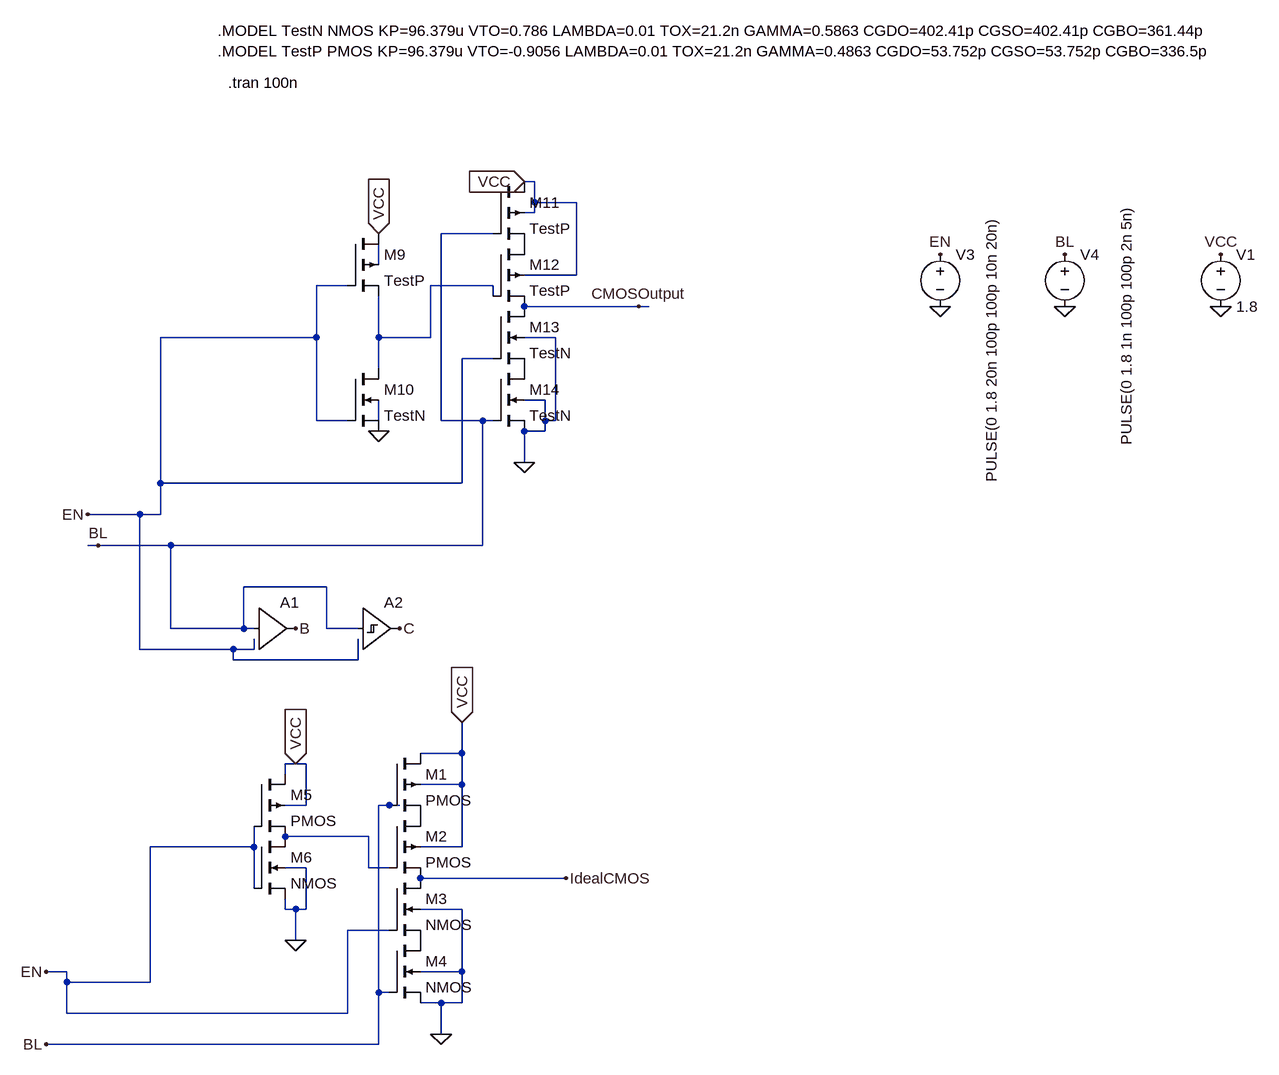
[diagram p0: schematic Tristatetest.asc]
Tristatetest.asc, the LTspice schematic file:
Version 4
SHEET 1 2480 2656
WIRE -128 96 -144 96
WIRE -128 128 -128 96
WIRE -64 128 -128 128
WIRE -128 144 -128 128
WIRE -128 144 -144 144
WIRE -192 176 -272 176
WIRE -368 224 -368 192
WIRE -64 240 -64 128
WIRE -64 240 -144 240
WIRE -416 256 -464 256
WIRE -192 256 -288 256
WIRE -192 272 -192 256
WIRE 32 288 -144 288
WIRE 48 288 32 288
WIRE -464 336 -464 256
WIRE -464 336 -704 336
WIRE -368 336 -368 272
WIRE -288 336 -288 256
WIRE -288 336 -368 336
WIRE -96 336 -144 336
WIRE -192 368 -240 368
WIRE -368 384 -368 336
WIRE -112 432 -144 432
WIRE -464 464 -464 336
WIRE -416 464 -464 464
WIRE -368 464 -368 432
WIRE -272 464 -272 176
WIRE -208 464 -272 464
WIRE -192 464 -208 464
WIRE -112 464 -112 432
WIRE -96 464 -96 336
WIRE -96 464 -112 464
WIRE -112 480 -112 464
WIRE -112 480 -144 480
WIRE -144 528 -144 480
WIRE -704 560 -704 336
WIRE -240 560 -240 368
WIRE -240 560 -704 560
WIRE -736 608 -816 608
WIRE -704 608 -704 560
WIRE -704 608 -736 608
WIRE -800 656 -816 656
WIRE -688 656 -800 656
WIRE -208 656 -208 464
WIRE -208 656 -688 656
WIRE -448 720 -576 720
WIRE -688 784 -688 656
WIRE -576 784 -576 720
WIRE -576 784 -688 784
WIRE -560 784 -576 784
WIRE -448 784 -448 720
WIRE -400 784 -448 784
WIRE -736 816 -736 608
WIRE -592 816 -736 816
WIRE -560 816 -560 800
WIRE -560 816 -592 816
WIRE -592 832 -592 816
WIRE -400 832 -400 800
WIRE -400 832 -592 832
WIRE -240 976 -240 928
WIRE -240 976 -304 976
WIRE -496 992 -512 992
WIRE -480 992 -496 992
WIRE -512 1008 -512 992
WIRE -240 1024 -240 976
WIRE -240 1024 -304 1024
WIRE -480 1056 -480 992
WIRE -480 1056 -512 1056
WIRE -352 1056 -368 1056
WIRE -336 1056 -352 1056
WIRE -384 1104 -512 1104
WIRE -560 1120 -560 1088
WIRE -560 1120 -720 1120
WIRE -240 1120 -240 1024
WIRE -240 1120 -304 1120
WIRE -480 1152 -512 1152
WIRE -384 1152 -384 1104
WIRE -352 1152 -384 1152
WIRE -80 1168 -304 1168
WIRE -560 1184 -560 1120
WIRE -512 1216 -512 1200
WIRE -496 1216 -512 1216
WIRE -480 1216 -480 1152
WIRE -480 1216 -496 1216
WIRE -240 1216 -304 1216
WIRE -352 1248 -416 1248
WIRE -496 1264 -496 1216
WIRE -848 1312 -880 1312
WIRE -240 1312 -240 1216
WIRE -240 1312 -304 1312
WIRE -848 1328 -848 1312
WIRE -720 1328 -720 1120
WIRE -720 1328 -848 1328
WIRE -368 1344 -368 1056
WIRE -352 1344 -368 1344
WIRE -272 1360 -304 1360
WIRE -240 1360 -240 1312
WIRE -240 1360 -272 1360
WIRE -848 1376 -848 1328
WIRE -416 1376 -416 1248
WIRE -416 1376 -848 1376
WIRE -272 1408 -272 1360
WIRE -368 1424 -368 1344
WIRE -368 1424 -880 1424
FLAG -368 176 VCC
IOPIN -368 176 In
FLAG -368 480 0
FLAG -144 96 VCC
IOPIN -144 96 In
FLAG -144 528 0
FLAG -816 608 EN
FLAG 32 288 CMOSOutput
FLAG -800 656 BL
FLAG 928 288 0
FLAG 496 288 0
FLAG 688 288 0
FLAG 928 208 VCC
FLAG 688 208 BL
FLAG 496 208 EN
FLAG -496 784 B
FLAG -336 784 C
FLAG -80 1168 IdealCMOS
FLAG -240 928 VCC
IOPIN -240 928 In
FLAG -272 1408 0
FLAG -496 992 VCC
IOPIN -496 992 In
FLAG -496 1264 0
FLAG -880 1312 EN
FLAG -880 1424 BL
SYMBOL pmos4 -416 176 R0
SYMATTR InstName M9
SYMATTR Value TestP
SYMATTR Value2 l=10u w=40u
SYMBOL nmos4 -416 384 R0
SYMATTR InstName M10
SYMATTR Value TestN
SYMATTR Value2 l=10u w=20u
SYMBOL pmos4 -192 96 R0
SYMATTR InstName M11
SYMATTR Value TestP
SYMATTR Value2 l=10u w=40u
SYMBOL pmos4 -192 192 R0
SYMATTR InstName M12
SYMATTR Value TestP
SYMATTR Value2 l=10u w=40u
SYMBOL nmos4 -192 288 R0
SYMATTR InstName M13
SYMATTR Value TestN
SYMATTR Value2 l=10u w=20u
SYMBOL nmos4 -192 384 R0
SYMATTR InstName M14
SYMATTR Value TestN
SYMATTR Value2 l=10u w=20u
SYMBOL voltage 928 192 R0
WINDOW 123 0 0 Left 0
WINDOW 39 0 0 Left 0
SYMATTR InstName V1
SYMATTR Value 1.8
SYMBOL voltage 496 192 R0
WINDOW 3 79 -45 VRight 2
WINDOW 123 0 0 Left 0
WINDOW 39 0 0 Left 0
SYMATTR Value PULSE(0 1.8 20n 100p 100p 10n 20n)
SYMATTR InstName V3
SYMBOL voltage 688 192 R0
WINDOW 3 95 -61 VRight 2
WINDOW 123 0 0 Left 0
WINDOW 39 0 0 Left 0
SYMATTR Value PULSE(0 1.8 1n 100p 100p 2n 5n)
SYMATTR InstName V4
SYMBOL Digital\\buf1 -560 720 R0
SYMATTR InstName A1
SYMBOL Digital\\schmtbuf -400 720 R0
SYMATTR InstName A2
SYMBOL pmos4 -352 976 R0
SYMATTR InstName M1
SYMATTR Value2 l=10u w=40u
SYMBOL pmos4 -352 1072 R0
SYMATTR InstName M2
SYMATTR Value2 l=10u w=40u
SYMBOL nmos4 -352 1168 R0
SYMATTR InstName M3
SYMATTR Value2 l=10u w=20u
SYMBOL nmos4 -352 1264 R0
SYMATTR InstName M4
SYMATTR Value2 l=10u w=20u
SYMBOL pmos4 -560 1008 R0
SYMATTR InstName M5
SYMBOL nmos4 -560 1104 R0
SYMATTR InstName M6
TEXT -616 -136 Left 2 !.MODEL TestN NMOS KP=96.379u VTO=0.786 LAMBDA=0.01 TOX=21.2n GAMMA=0.5863 CGDO=402.41p CGSO=402.41p CGBO=361.44p\n.MODEL TestP PMOS KP=96.379u VTO=-0.9056 LAMBDA=0.01 TOX=21.2n GAMMA=0.4863 CGDO=53.752p CGSO=53.752p CGBO=336.5p
TEXT -600 -56 Left 2 !.tran 100n

The netlist it stands for:
* Tristatetest.asc
M9 VCC EN N002 N001 TestP l=10u w=40u
M10 N002 EN 0 N003 TestN l=10u w=20u
M11 VCC BL P001 VCC TestP l=10u w=40u
M12 P001 N002 CMOSOutput VCC TestP l=10u w=40u
M13 CMOSOutput EN P002 0 TestN l=10u w=20u
M14 P002 BL 0 0 TestN l=10u w=20u
V1 VCC 0 1.8
V3 EN 0 PULSE(0 1.8 20n 100p 100p 10n 20n)
V4 BL 0 PULSE(0 1.8 1n 100p 100p 2n 5n)
A1 BL EN EN EN EN EN B EN BUF
A2 BL EN EN EN EN EN C EN SCHMITT
M1 VCC BL P003 VCC PMOS l=10u w=40u
M2 P003 N004 IdealCMOS VCC PMOS l=10u w=40u
M3 IdealCMOS EN P004 0 NMOS l=10u w=20u
M4 P004 BL 0 0 NMOS l=10u w=20u
M5 VCC EN N004 VCC PMOS
M6 N004 EN 0 0 NMOS
.model NMOS NMOS
.model PMOS PMOS
.lib standard.mos
.MODEL TestN NMOS KP=96.379u VTO=0.786 LAMBDA=0.01 TOX=21.2n GAMMA=0.5863 CGDO=402.41p CGSO=402.41p CGBO=361.44p
.MODEL TestP PMOS KP=96.379u VTO=-0.9056 LAMBDA=0.01 TOX=21.2n GAMMA=0.4863 CGDO=53.752p CGSO=53.752p CGBO=336.5p
.tran 100n
.backanno
.end

* Results of the author's LTspice run, read from the files saved beside the schematic
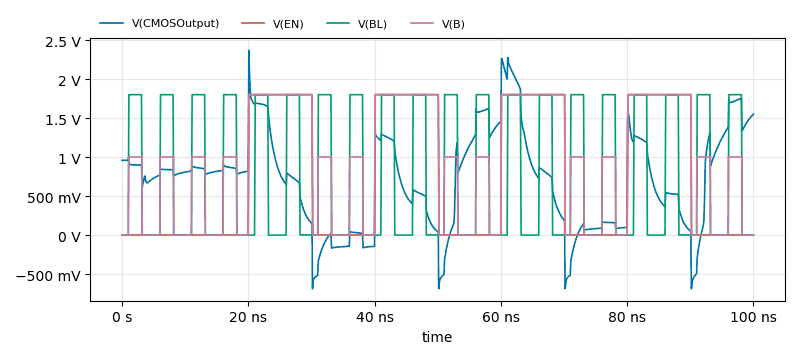
[diagram p1: Transient Analysis of Tristatetest.asc, plotted from the saved traces]
* Transient Analysis, 1 run:
*   V(CMOSOutput): min -689.1 mV, max 2.368 V, average 705.4 mV, rms 940.4 mV, last 1.55 V
*   V(EN): min 0 V, max 1.8 V, average 727.1 mV, rms 1.142 V, last 0 V
*   V(BL): min 0 V, max 1.8 V, average 756 mV, rms 1.158 V, last 0 V
*   V(B): min 0 V, max 1.8 V, average 984.3 mV, rms 1.25 V, last 0 V